# Altium schematic sheet MainDin.SchDoc
size A4
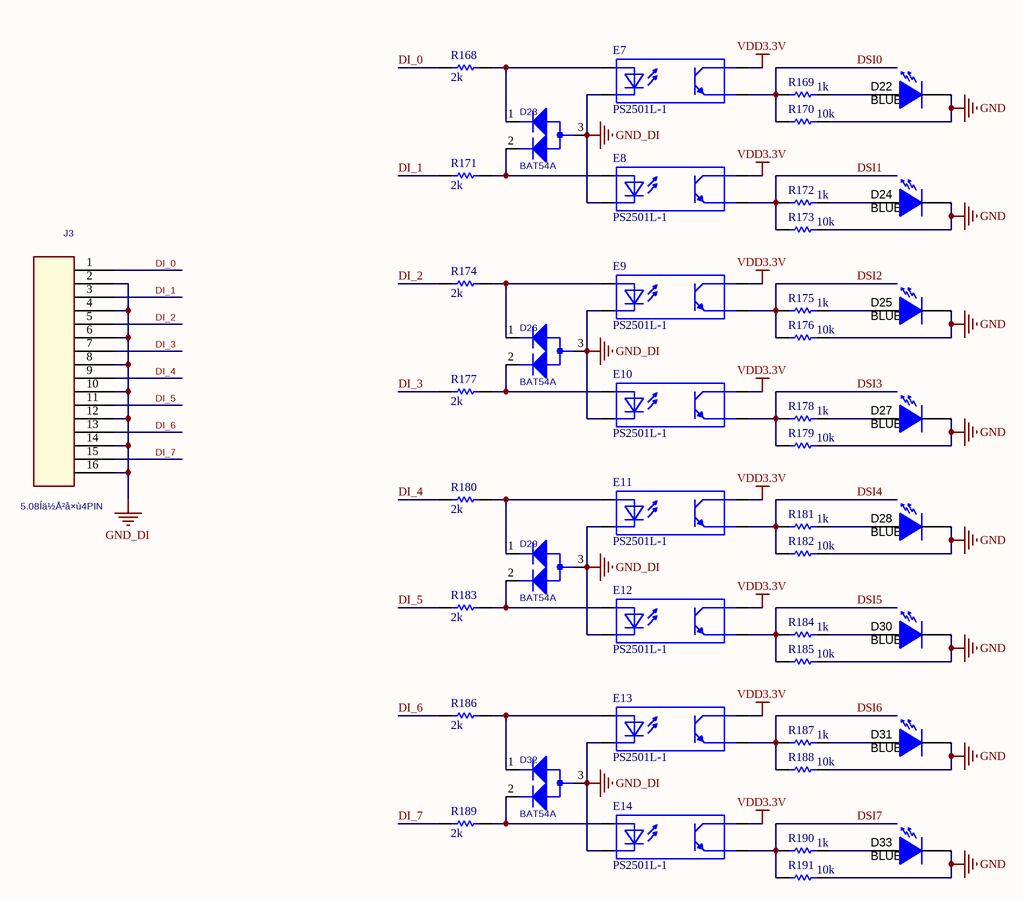
[diagram p0: MainDin.SchDoc]

## Parts
D22  value BLUE  [D0805]  (hidden comment: SML-P12YTT86)
D23  BAT54A  [SOT23]
D24  value BLUE  [D0805]  (hidden comment: SML-P12YTT86)
D25  value BLUE  [D0805]  (hidden comment: SML-P12YTT86)
D26  BAT54A  [SOT23]
D27  value BLUE  [D0805]  (hidden comment: SML-P12YTT86)
D28  value BLUE  [D0805]  (hidden comment: SML-P12YTT86)
D29  BAT54A  [SOT23]
D30  value BLUE  [D0805]  (hidden comment: SML-P12YTT86)
D31  value BLUE  [D0805]  (hidden comment: SML-P12YTT86)
D32  BAT54A  [SOT23]
D33  value BLUE  [D0805]  (hidden comment: SML-P12YTT86)
E7  PS2501L-1  [NEC2501]
E8  PS2501L-1  [NEC2501]
E9  PS2501L-1  [NEC2501]
E10  PS2501L-1  [NEC2501]
E11  PS2501L-1  [NEC2501]
E12  PS2501L-1  [NEC2501]
E13  PS2501L-1  [NEC2501]
E14  PS2501L-1  [NEC2501]
J3  5.08Íä½Å²å×ù4PIN  [JIEKE_16PX508]
R168  value 2k  [0805]  (hidden comment: Res Semi)
R169  value 1k  [0805]  (hidden comment: Res Semi)
R170  value 10k  [0805]  (hidden comment: Res Semi)
R171  value 2k  [0805]  (hidden comment: Res Semi)
R172  value 1k  [0805]  (hidden comment: Res Semi)
R173  value 10k  [0805]  (hidden comment: Res Semi)
R174  value 2k  [0805]  (hidden comment: Res Semi)
R175  value 1k  [0805]  (hidden comment: Res Semi)
R176  value 10k  [0805]  (hidden comment: Res Semi)
R177  value 2k  [0805]  (hidden comment: Res Semi)
R178  value 1k  [0805]  (hidden comment: Res Semi)
R179  value 10k  [0805]  (hidden comment: Res Semi)
R180  value 2k  [0805]  (hidden comment: Res Semi)
R181  value 1k  [0805]  (hidden comment: Res Semi)
R182  value 10k  [0805]  (hidden comment: Res Semi)
R183  value 2k  [0805]  (hidden comment: Res Semi)
R184  value 1k  [0805]  (hidden comment: Res Semi)
R185  value 10k  [0805]  (hidden comment: Res Semi)
R186  value 2k  [0805]  (hidden comment: Res Semi)
R187  value 1k  [0805]  (hidden comment: Res Semi)
R188  value 10k  [0805]  (hidden comment: Res Semi)
R189  value 2k  [0805]  (hidden comment: Res Semi)
R190  value 1k  [0805]  (hidden comment: Res Semi)
R191  value 10k  [0805]  (hidden comment: Res Semi)

## Nets
GND: D22.2(K) D24.2(K) D25.2(K) D27.2(K) D28.2(K) D30.2(K) D31.2(K) D33.2(K) R170.2 R173.2 R176.2 R179.2 R182.2 R185.2 R188.2 R191.2
GND_DI: D23.3 D26.3 D29.3 D32.3 E7.2 E8.2 E9.2 E10.2 E11.2 E12.2 E13.2 E14.2 J3.2 J3.4 J3.6 J3.8 J3.10 J3.12 J3.14 J3.16
VDD3.3V: E7.4 E8.4 E9.4 E10.4 E11.4 E12.4 E13.4 E14.4
DI_0: J3.1 R168.1
DI_1: J3.3 R171.1
DI_2: J3.5 R174.1
DI_3: J3.7 R177.1
DI_4: J3.9 R180.1
DI_5: J3.11 R183.1
DI_6: J3.13 R186.1
DI_7: J3.15 R189.1
DSI0: E7.3 R169.1 R170.1
DSI1: E8.3 R172.1 R173.1
DSI2: E9.3 R175.1 R176.1
DSI3: E10.3 R178.1 R179.1
DSI4: E11.3 R181.1 R182.1
DSI5: E12.3 R184.1 R185.1
DSI6: E13.3 R187.1 R188.1
DSI7: E14.3 R190.1 R191.1
NetD22_1: D22.1(A) R169.2
NetD23_1: D23.1 E7.1 R168.2
NetD23_2: D23.2 E8.1 R171.2
NetD24_1: D24.1(A) R172.2
NetD25_1: D25.1(A) R175.2
NetD26_1: D26.1 E9.1 R174.2
NetD26_2: D26.2 E10.1 R177.2
NetD27_1: D27.1(A) R178.2
NetD28_1: D28.1(A) R181.2
NetD29_1: D29.1 E11.1 R180.2
NetD29_2: D29.2 E12.1 R183.2
NetD30_1: D30.1(A) R184.2
NetD31_1: D31.1(A) R187.2
NetD32_1: D32.1 E13.1 R186.2
NetD32_2: D32.2 E14.1 R189.2
NetD33_1: D33.1(A) R190.2

## Library data of the parts
D22 D24 D25 D27 D28 D30 D31 D33 = SML-P12YTT86: LED, GREEN SMD; Manufacturer: Rohm; Type: InGaN; Vf_V: 2.1; Value2: 2.1V; Io_A: 0.02; Tjmax_C: 85; Value1: W; Color: yellow; U/M: EA; CompType: LED; PartNumber: SML-P12YTT86; SymbolVersion: 2008-12-08; MountType: SMT; RoHS: Y; PackageReference: Yellow LED; Published: 2008-07-11; Publisher: Texas Instruments; ComponentLink1URL: http://rohmfs.rohm.com/en/products/databook/datasheet/opto/led/chip_mono/sml-p1.pdf; ComponentLink1Description: Datasheet link; LatestRevisionDate: 2013-06-24; LatestRevisionNote: Updated supplier queries; Supplier 1: Digi-Key; Supplier Part Number 1: 511-1595-1-ND; Supplier 2: Mouser; Supplier Part Number 2: 755-SML-P12YTT86; Supplier 3: Farnell; Supplier Part Number 3: 1973107
D23 D26 D29 D32 = BAT54A/SOT_2: PCB Footprint SMD: SMD; SMT: Y; TOLERANCE: =D22_TOLERANCE
E7-E14 = OPTO: 光耦
J3 = CON16: PCB Footprint SMD: ²å¼þ; TOLERANCE: =J56_TOLERANCE
R168-R191 = Res Semi: Semiconductor Resistor; Published: 8-Jun-2000; LatestRevisionDate: 17-Jul-2002; LatestRevisionNote: Re-released for DXP Platform.; PackageReference: AXIAL-0.5; Publisher: Altium Limited